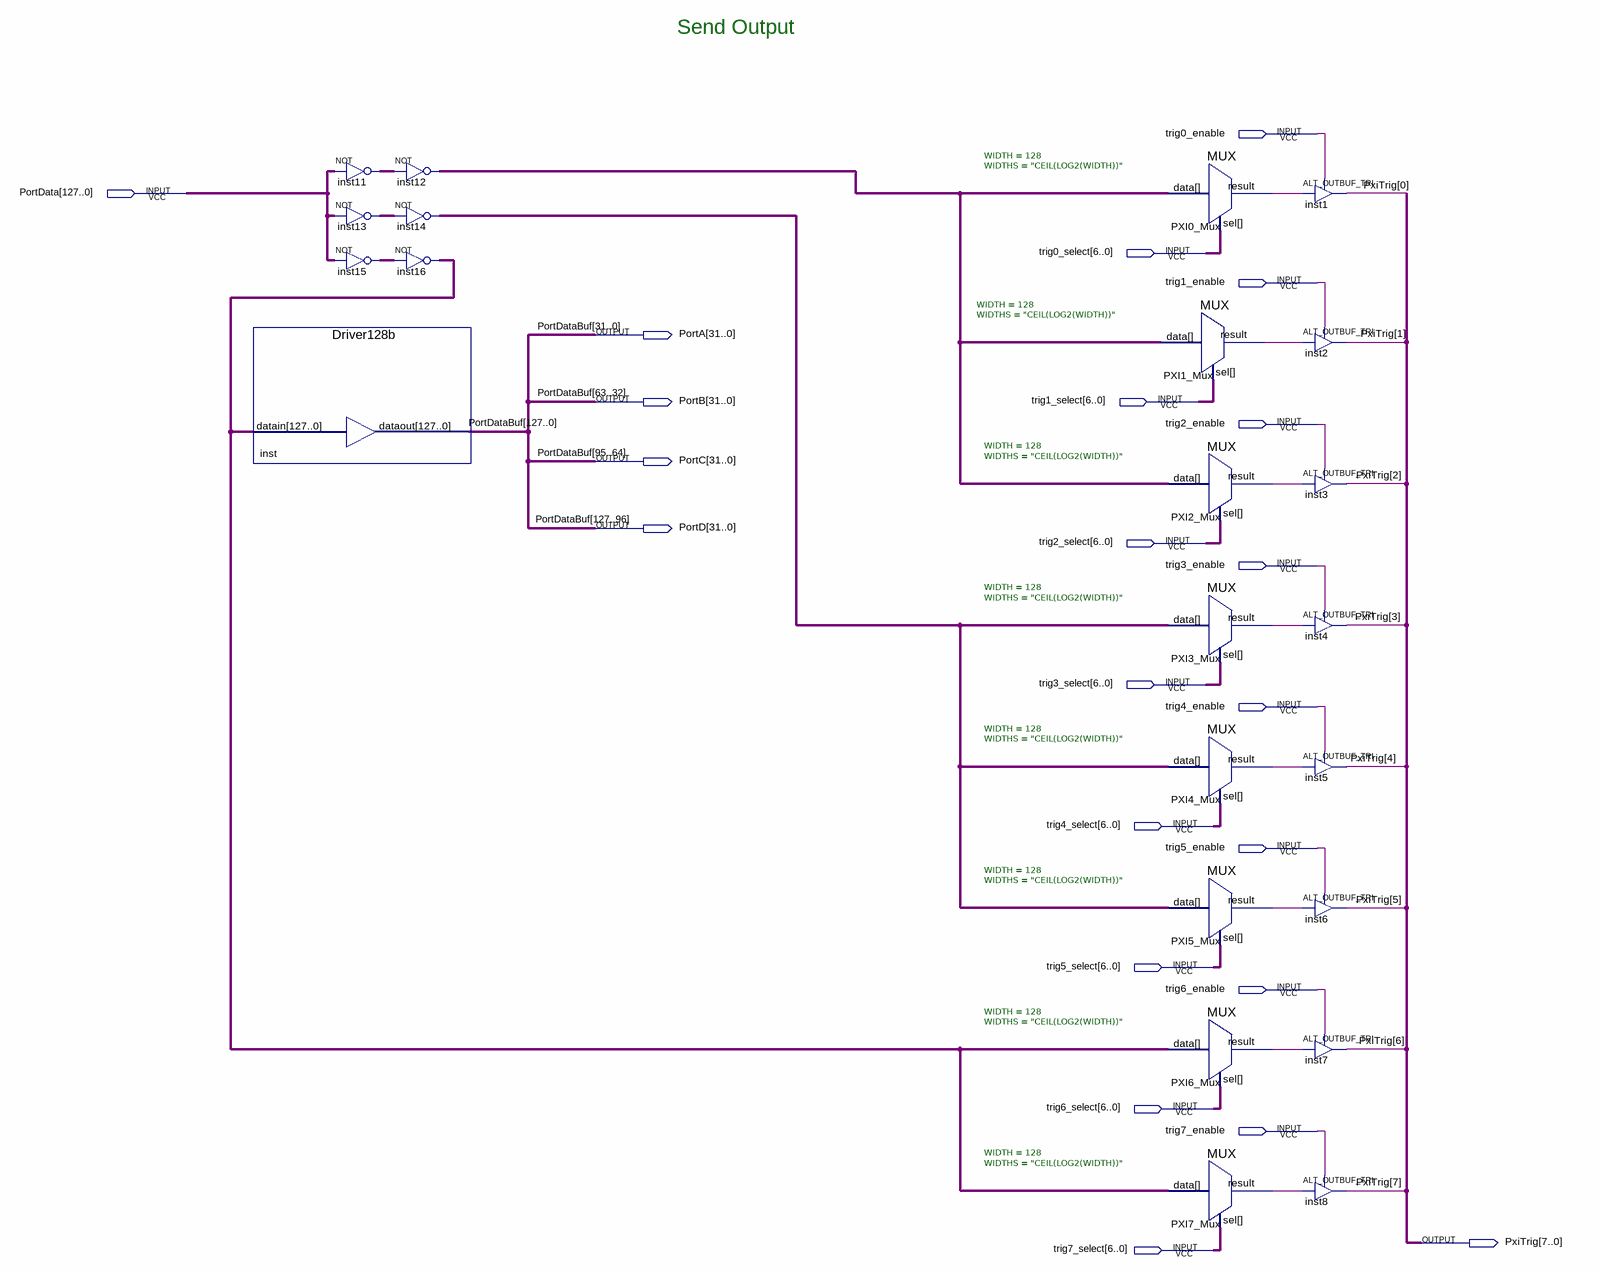
[diagram p0: schematic sheet]
// Quartus schematic Output_Drive.bdf as structural Verilog: 23 symbols, 22 pins
module Output_Drive (
  input  trig0_enable,
  input  [127:0] PortData,
  input  [6:0] trig0_select,
  input  trig1_enable,
  input  [6:0] trig1_select,
  input  trig2_enable,
  input  [6:0] trig2_select,
  input  trig3_enable,
  input  [6:0] trig3_select,
  input  trig4_enable,
  input  [6:0] trig4_select,
  input  trig5_enable,
  input  [6:0] trig5_select,
  input  trig6_enable,
  input  [6:0] trig6_select,
  input  trig7_enable,
  input  [6:0] trig7_select,
  output [31:0] PortA,
  output [31:0] PortB,
  output [31:0] PortC,
  output [31:0] PortD,
  output [7:0] PxiTrig
);

  wire PXI0_Mux_result, PXI1_Mux_result, PXI2_Mux_result, PXI3_Mux_result, PXI4_Mux_result, PXI5_Mux_result,
       PXI6_Mux_result, PXI7_Mux_result;
  wire [127:0] inst11_out, inst12_out, inst13_out, inst14_out, inst15_out, inst16_out;

  Driver128b inst (.datain(inst16_out), .dataout({PortD, PortC, PortB, PortA}));
  assign inst11_out = ~PortData;  // NOT inst11, 128 bits wide
  assign inst13_out = ~PortData;  // NOT inst13, 128 bits wide
  assign inst15_out = ~PortData;  // NOT inst15, 128 bits wide
  assign inst12_out = ~inst11_out;  // NOT inst12, 128 bits wide
  assign inst14_out = ~inst13_out;  // NOT inst14, 128 bits wide
  assign inst16_out = ~inst15_out;  // NOT inst16, 128 bits wide
  MUX #(.WIDTH(128), .WIDTHS("CEIL(LOG2(WIDTH))")) PXI0_Mux (
    .data(inst12_out), .sel(trig0_select), .result(PXI0_Mux_result));
  MUX #(.WIDTH(128), .WIDTHS("CEIL(LOG2(WIDTH))")) PXI1_Mux (
    .data(inst12_out), .sel(trig1_select), .result(PXI1_Mux_result));
  MUX #(.WIDTH(128), .WIDTHS("CEIL(LOG2(WIDTH))")) PXI2_Mux (
    .data(inst12_out), .sel(trig2_select), .result(PXI2_Mux_result));
  MUX #(.WIDTH(128), .WIDTHS("CEIL(LOG2(WIDTH))")) PXI3_Mux (
    .data(inst14_out), .sel(trig3_select), .result(PXI3_Mux_result));
  MUX #(.WIDTH(128), .WIDTHS("CEIL(LOG2(WIDTH))")) PXI4_Mux (
    .data(inst14_out), .sel(trig4_select), .result(PXI4_Mux_result));
  MUX #(.WIDTH(128), .WIDTHS("CEIL(LOG2(WIDTH))")) PXI5_Mux (
    .data(inst14_out), .sel(trig5_select), .result(PXI5_Mux_result));
  MUX #(.WIDTH(128), .WIDTHS("CEIL(LOG2(WIDTH))")) PXI6_Mux (
    .data(inst16_out), .sel(trig6_select), .result(PXI6_Mux_result));
  MUX #(.WIDTH(128), .WIDTHS("CEIL(LOG2(WIDTH))")) PXI7_Mux (
    .data(inst16_out), .sel(trig7_select), .result(PXI7_Mux_result));
  ALT_OUTBUF_TRI inst1 (.i(PXI0_Mux_result), .oe(trig0_enable), .o(PxiTrig[0]));
  ALT_OUTBUF_TRI inst2 (.i(PXI1_Mux_result), .oe(trig1_enable), .o(PxiTrig[1]));
  ALT_OUTBUF_TRI inst3 (.i(PXI2_Mux_result), .oe(trig2_enable), .o(PxiTrig[2]));
  ALT_OUTBUF_TRI inst4 (.i(PXI3_Mux_result), .oe(trig3_enable), .o(PxiTrig[3]));
  ALT_OUTBUF_TRI inst5 (.i(PXI4_Mux_result), .oe(trig4_enable), .o(PxiTrig[4]));
  ALT_OUTBUF_TRI inst6 (.i(PXI5_Mux_result), .oe(trig5_enable), .o(PxiTrig[5]));
  ALT_OUTBUF_TRI inst7 (.i(PXI6_Mux_result), .oe(trig6_enable), .o(PxiTrig[6]));
  ALT_OUTBUF_TRI inst8 (.i(PXI7_Mux_result), .oe(trig7_enable), .o(PxiTrig[7]));

  // Other names for the same wires on the sheet: PortDataBuf[127:0] = {PortD, PortC, PortB, PortA}

  // Notes on the sheet:
  //   Send Output
endmodule
